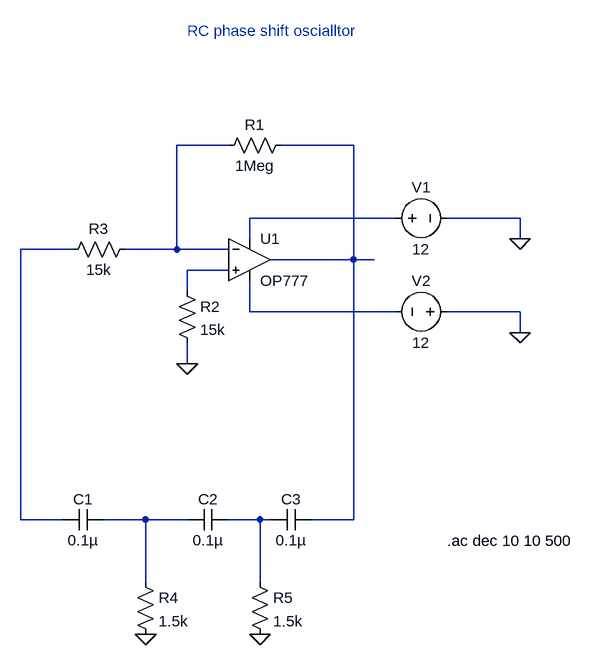
[diagram p0: schematic RC_shift_oscillator.asc]
RC_shift_oscillator.asc, the LTspice schematic file:
Version 4
SHEET 1 880 776
WIRE 0 -16 -80 -16
WIRE 192 -16 80 -16
WIRE 256 96 32 96
WIRE 448 96 336 96
WIRE 32 128 32 96
WIRE 448 128 448 96
WIRE -240 144 -320 144
WIRE -80 144 -80 -16
WIRE -80 144 -160 144
WIRE 0 144 -80 144
WIRE 192 160 192 -16
WIRE 192 160 64 160
WIRE 224 160 192 160
WIRE 0 176 -64 176
WIRE -64 208 -64 176
WIRE 32 240 32 192
WIRE 256 240 32 240
WIRE 448 240 336 240
WIRE 448 272 448 240
WIRE -64 320 -64 288
WIRE -320 560 -320 144
WIRE -256 560 -320 560
WIRE -128 560 -192 560
WIRE -64 560 -128 560
WIRE 48 560 0 560
WIRE 64 560 48 560
WIRE 192 560 192 160
WIRE 192 560 128 560
WIRE -128 656 -128 560
WIRE 48 656 48 560
FLAG 448 128 0
FLAG 448 272 0
FLAG -64 320 0
FLAG -128 736 0
FLAG 48 736 0
SYMBOL voltage 240 96 R270
WINDOW 0 32 56 VTop 2
WINDOW 3 -32 56 VBottom 2
WINDOW 123 0 0 Left 0
WINDOW 39 0 0 Left 0
SYMATTR InstName V1
SYMATTR Value 12
SYMBOL voltage 352 240 R90
WINDOW 0 -32 56 VBottom 2
WINDOW 3 32 56 VTop 2
WINDOW 123 0 0 Left 0
WINDOW 39 0 0 Left 0
SYMATTR InstName V2
SYMATTR Value 12
SYMBOL res 96 -32 R90
WINDOW 0 0 56 VBottom 2
WINDOW 3 32 56 VTop 2
SYMATTR InstName R1
SYMATTR Value 1Meg
SYMBOL res -80 192 R0
SYMATTR InstName R2
SYMATTR Value 15k
SYMBOL res -144 128 R90
WINDOW 0 0 56 VBottom 2
WINDOW 3 32 56 VTop 2
SYMATTR InstName R3
SYMATTR Value 15k
SYMBOL cap -192 544 R90
WINDOW 0 0 32 VBottom 2
WINDOW 3 32 32 VTop 2
SYMATTR InstName C1
SYMATTR Value 0.1µ
SYMBOL cap 0 544 R90
WINDOW 0 0 32 VBottom 2
WINDOW 3 32 32 VTop 2
SYMATTR InstName C2
SYMATTR Value 0.1µ
SYMBOL cap 128 544 R90
WINDOW 0 0 32 VBottom 2
WINDOW 3 32 32 VTop 2
SYMATTR InstName C3
SYMATTR Value 0.1µ
SYMBOL res -144 640 R0
SYMATTR InstName R4
SYMATTR Value 1.5k
SYMBOL res 32 640 R0
SYMATTR InstName R5
SYMATTR Value 1.5k
SYMBOL OpAmps\\OP777 32 96 R0
SYMATTR InstName U1
TEXT -64 -192 Left 2 ;RC phase shift oscialltor
TEXT 336 592 Left 2 !.ac dec 10 10 500

The netlist it stands for:
* RC_shift_oscillator.asc
V1 N003 0 12
V2 0 N006 12
R1 N002 N001 1Meg
R2 N005 0 15k
R3 N001 N004 15k
C1 N007 N004 0.1µ
C2 N008 N007 0.1µ
C3 N002 N008 0.1µ
R4 N007 0 1.5k
R5 N008 0 1.5k
XU1 N005 N001 N003 N006 N002 OP777  ; pins In+ In- V+ V- OUT
* RC phase shift oscialltor
.ac dec 10 10 500
.lib ADI.lib
.backanno
.end